# EAGLE design pm25-bme680 (EAGLE 9.3.2)
AUTHOR: Jared Wolff; BOARD_NUMBER: BRD-0010; COMPANY: Circuit Dojo; DOC_NUMBER: SCH-0010; DOC_REV: 1; TITLE: Particle^2 Sensor
Assembly variants: Production
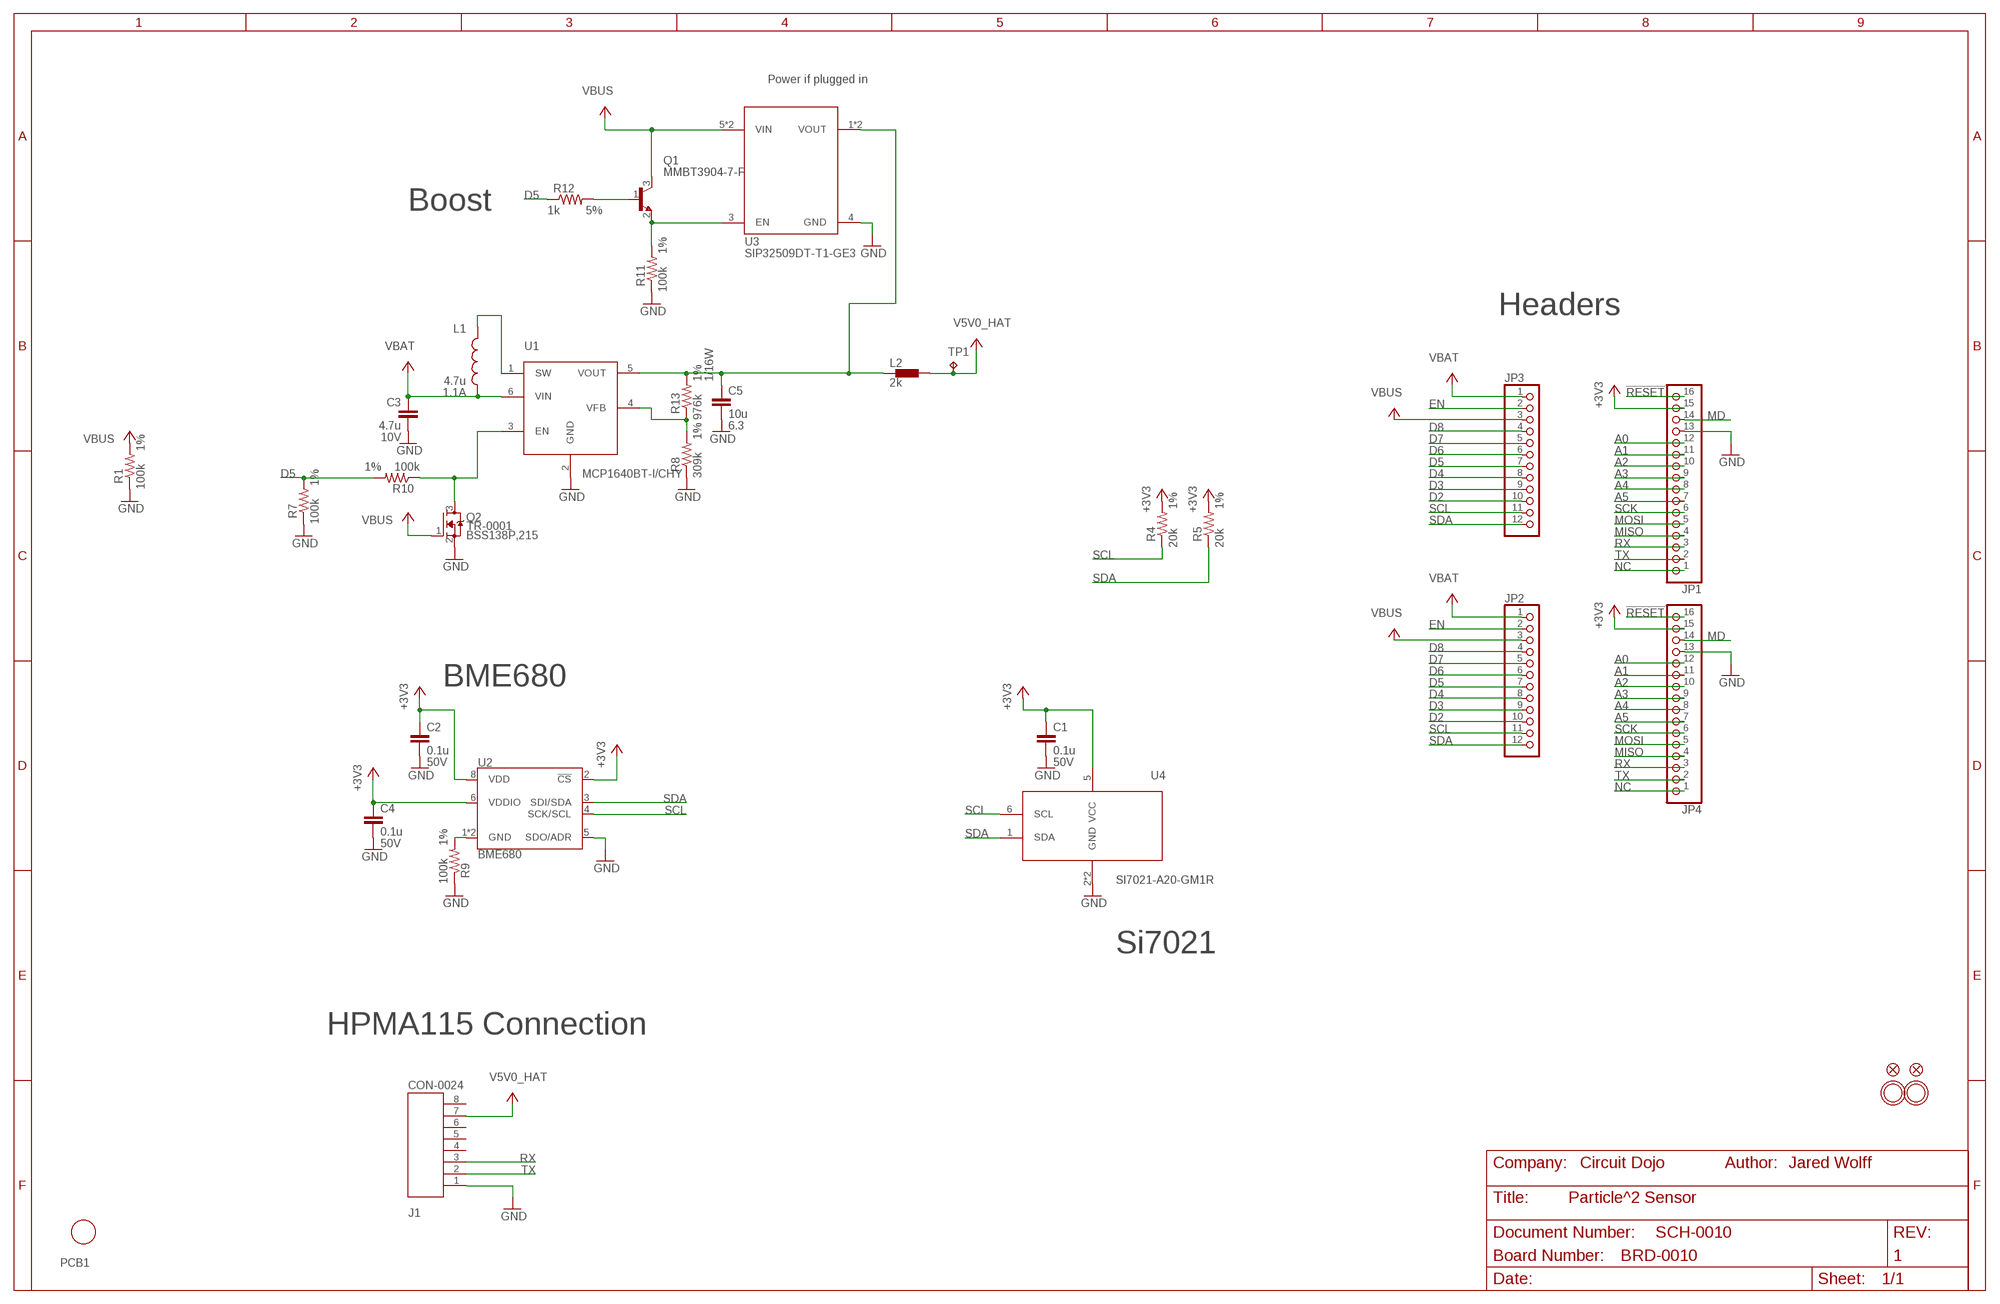
[diagram p0: schematic, sheet 1]

## Parts
C1  0.1u  CAP-0017  [CAPC1005X55N]  (not fitted in variant Production)
C2  0.1u  CAP-0017  [CAPC1005X55N]
C3  4.7u  CAP-0010  [C0603]
C4  0.1u  CAP-0017  [CAPC1005X55N]
C5  10u  CAP-10U-6.3V-0603  [C0603]
J1  CON-0024  [0532610871]
JP1  HEADER-1X16ROUND  [1X16_ROUND]
JP2  HEADER-1X12  [1X12_ROUND]  (not fitted in variant Production)
JP3  HEADER-1X12  [1X12_ROUND]
JP4  HEADER-1X16ROUND  [1X16_ROUND]  (not fitted in variant Production)
L1  4.7u  IND-0003  [IND-2P0X2P0X1P2]
L2  2k  FERRITE-0805  [R0805]
PCB1  PCB-BME680-SI7021  [PLACEHOLDER]
Q1  TRANSISTOR-NPN-40V-0.2A-SOT23  [SOT23]
Q2  TR-0001  [SOT23]
R1  100k  RES-0041  [R0402]  (not fitted in variant Production)
R4  20k  RES-0054  [R0402]
R5  20k  RES-0054  [R0402]
R7  100k  RES-0041  [R0402]
R8  309k  RES-309K-1%-0402  [R0402]
R9  100k  RES-0041  [R0402]
R10  100k  RES-0041  [R0402]
R11  100k  RES-0041  [R0402]
R12  1k  RES-0039  [R0402]
R13  976k  RES-976K-1%-0402  [R0402]
TP1  TP  [TP-1P27]
U1  POWER-VREG-FB-EN-SW-350MA  [SOT23-6]
U2  BME680  [LGA3.0X3.0]
U3  POWER-SWITCH-SIP32509DT  [SOT23-6]
U4  SI7021-A20-GM1R  [SON100P300X300X80-7N]  (not fitted in variant Production)
U$31  MOUNTINGHOLE2.5  [MOUNTINGHOLE_2.5_PLATED]
U$32  MOUNTINGHOLE2.5  [MOUNTINGHOLE_2.5_PLATED]
U$34  FIDUCIAL""  [FIDUCIAL_1MM]
U$35  FIDUCIAL""  [FIDUCIAL_1MM]

## Nets
!RESET: JP1.16 JP4.16
+3V3: C1.1 C2.1 C4.1 JP1.15 JP4.15 R4.2 R5.2 U2.2(!CS) U2.6(VDDIO) U2.8(VDD) U4.5(VCC)
A0: JP1.12 JP4.12
A1: JP1.11 JP4.11
A2: JP1.10 JP4.10
A3: JP1.9 JP4.9
A4: JP1.8 JP4.8
A5: JP1.7 JP4.7
D2: JP2.10 JP3.10
D3: JP2.9 JP3.9
D4: JP2.8 JP3.8
D5: JP2.7 JP3.7 R7.2 R10.2 R12.1
D6: JP2.6 JP3.6
D7: JP2.5 JP3.5
D8: JP2.4 JP3.4
EN: JP2.2 JP3.2
GND: C1.2 C2.2 C3.2 C4.2 C5.2 J1.1 JP1.13 JP4.13 Q2.2(S) R1.1 R7.1 R8.1 R9.1 R11.1 U1.2(GND) U2.5(SDO/ADR) U3.4(GND) U4.2(GND) U4.7(GND)
MD: JP1.14 JP4.14
MISO: JP1.4 JP4.4
MOSI: JP1.5 JP4.5
N$1: L1.P$1 U1.1(SW)
N$2: R8.2 R13.1 U1.4(VFB)
N$3: Q1.2(E) R11.2 U3.3(EN)
N$4: R9.2 U2.1(GND) U2.7(GND)
N$6: Q2.3(D) R10.1 U1.3(EN)
N$7: Q1.1(B) R12.2
NC: JP1.1 JP4.1
RX: J1.3 JP1.3 JP4.3
SCK: JP1.6 JP4.6
SCL: JP2.11 JP3.11 R4.1 U2.4(SCK/SCL) U4.6(SCL)
SDA: JP2.12 JP3.12 R5.1 U2.3(SDI/SDA) U4.1(SDA)
TX: J1.2 JP1.2 JP4.2
V5V0_BEAD: C5.1 L2.1 R13.2 U1.5(VOUT) U3.1(VOUT) U3.2(VOUT)
V5V0_HAT: J1.7 L2.2 TP1.P$1(TP) TP1.P$2(TP) TP1.TP
VBAT: C3.1 JP2.1 JP3.1 L1.P$2 U1.6(VIN)
VBUS: JP2.3 JP3.3 Q1.3(C) Q2.1(G) R1.2 U3.5(VIN) U3.6(VIN)
Unconnected: J1.4 J1.5 J1.6 J1.8

## Notes on the sheet
- Power if plugged in
- Boost
- Headers
- BME680
- Si7021
- HPMA115 Connection

## Library data of the parts
C1 C2 C4 = wolff-den:CAP-0017: CAP CER 0.1UF 35V X5R 0402; DESC: CAP CER 0.1UF 50V X5R 0402; DIGIKEYPN: 587-3499-1-ND; MF: Taiyo Yuden; MPN: UMK105BJ104KV-F; VOLTHIGH: 50V
C3 = wolff-den:CAP-0010: CAP CER 4.7UF 10V X5R 0603; DIGIKEYPN: 1276-6684-1-ND; MPN: CL10A475MP5LNNC; TEMPHIGH: 85; TEMPLOW: -55; VOLTHIGH: 10V
C5 = wolff-den:CAP: CAPACITOR; DESC: CAP CER 10UF 6.3V X5R 0603; DIGIKEYPN: 587-5869-1-ND; MPN: JMK107ABJ106MA-T; VOLTHIGH: 6.3
J1 = wolff-den:CON-0024; DESC: CONN HEADER SMD R/A 8POS 1.25MM; DIGIKEYPN: WM7626CT-ND; MPN: 0532610871
JP1 = microbuilder:HEADER-1X16: PIN HEADER; MPN: PPPC161LFBN-RC
JP2 = microbuilder:HEADER-1X12
JP3 = microbuilder:HEADER-1X12; MPN: PPPC121LFBN-RC
JP4 = microbuilder:HEADER-1X16: PIN HEADER
L1 = wolff-den:IND-0003: FIXED IND 4.7UH 750MA 390 MOHM; CURRENT: 1.1A; DIGIKEYPN: 587-4705-1-ND; MPN: NRV2012T4R7MGF
L2 = wolff-den:FERRITE: FERRITE BEAD; DESC: FERRITE BEAD 2 KOHM 0805 1LN; DIGIKEYPN: 1276-6330-1-ND; MPN: CIM21J202NE
PCB1 = wolff-den:PCB; MPN: BRD-0011
Q1 = wolff-den:TRANSISTOR: TRANSISTOR; DESC: TRANS NPN 40V 0.2A SMD SOT23-3; DIGIKEYPN: MMBT3904-FDICT-ND; MPN: MMBT3904-7-F
Q2 = wolff-den:TR-0001: MOSFET N-CH 60V 360MA TO-236AB; DIGIKEYPN: 1727-1142-1-ND; MPN: BSS138P,215; TEMPHIGH: 150; TEMPLOW: -55
R1 R7 R9-R11 = wolff-den:RES-0041: RES SMD 100K OHM 1% 1/16W 0402; DIGIKEYPN: 311-100KLRCT-ND; MPN: RC0402FR07100KL; TOLERANCE: 1%; VENDOR: Yageo
R4 R5 = wolff-den:RES-0054: RES SMD 20K OHM 1% 1/16W 0402; DIGIKEYPN: 311-20.0KLRCT-ND; MPN: RC0402FR-0720KL; TOLERANCE: 1%; VENDOR: Yageo
R8 = wolff-den:RES: RESISTOR; DESC: RES SMD 309K OHM 1% 1/16W 0402; DIGIKEYPN: YAG3108CT-ND; MPN: RC0402FR-07309KL; POWER: 1/16W; TOLERANCE: 1%
R12 = wolff-den:RES-0039: RES SMD 1K OHM 5% 1/16W 0402; DIGIKEYPN: 311-1.0KJRCT-ND; MPN: RC0402JR-071KL; TOLERANCE: 5%; VENDOR: Yageo
R13 = wolff-den:RES: RESISTOR; DESC: RES SMD 976K OHM 1% 1/16W 0402; DIGIKEYPN: YAG3265CT-ND; MPN: RC0402FR-07976KL; POWER: 1/16W; TOLERANCE: 1%
TP1 = wolff-den:TP: TEST POINT
U1 = wolff-den:POWER-VREG-FB-EN-SW: IC CONV BOOST SOT-23-6; DIGIKEYPN: MCP1640BT-I/CHYCT-ND; MPN: MCP1640BT-I/CHY; TEMPHIGH: 125; TEMPLOW: -40; VOLTHIGH: 5.5V; VOLTLOW: 0.8V
U2 = wolff-den:BME680: Bosch BME680 – Combined Humidity and Pressure Sensor The BME680 is as combined digital humidity, pressure and temperature sensor based on proven sensing principles. The sensor module is housed in an extremely compact metal-lid LGA package with a footprint of only 3.0×3.0mm with a height of 0.93mm. Its small dimensions and its low power consumption allow the implementation in battery driven devices such as handsets, GPS modules or watches.; DESC: SENSOR RH PRESSURE TEMP VOC; DIGIKEYPN: 828-1077-1-ND; MF: Bosch Sensortec; MPN: BME680
U3 = wolff-den:POWER-SWITCH: IC SWITCH; DESC: IC LOAD SWITCH SOT23-6; DIGIKEYPN: SIP32509DT-T1-GE3CT-ND; MPN: SIP32509DT-T1-GE3
U4 = wolff-den:SI7021-A20-GM1R; DESC: SENS HUMID/TEMP 3.6V I2C 2% 6DFN; DIGIKEYPN: 336-4380-1-ND; MPN: SI7021-A20-GM1R
U$31 U$32 = microbuilder:MOUNTINGHOLE: Mounting Hole For #2 screws (0.086"/2.18mm width, 0.094"/2.4mm hole) use 2.5mm; BOM: EXCLUDE
U$34 U$35 = microbuilder:FIDUCIAL: Fiducial Alignment Points Various fiducial points for machine vision alignment.; BOM: EXCLUDE

## Board
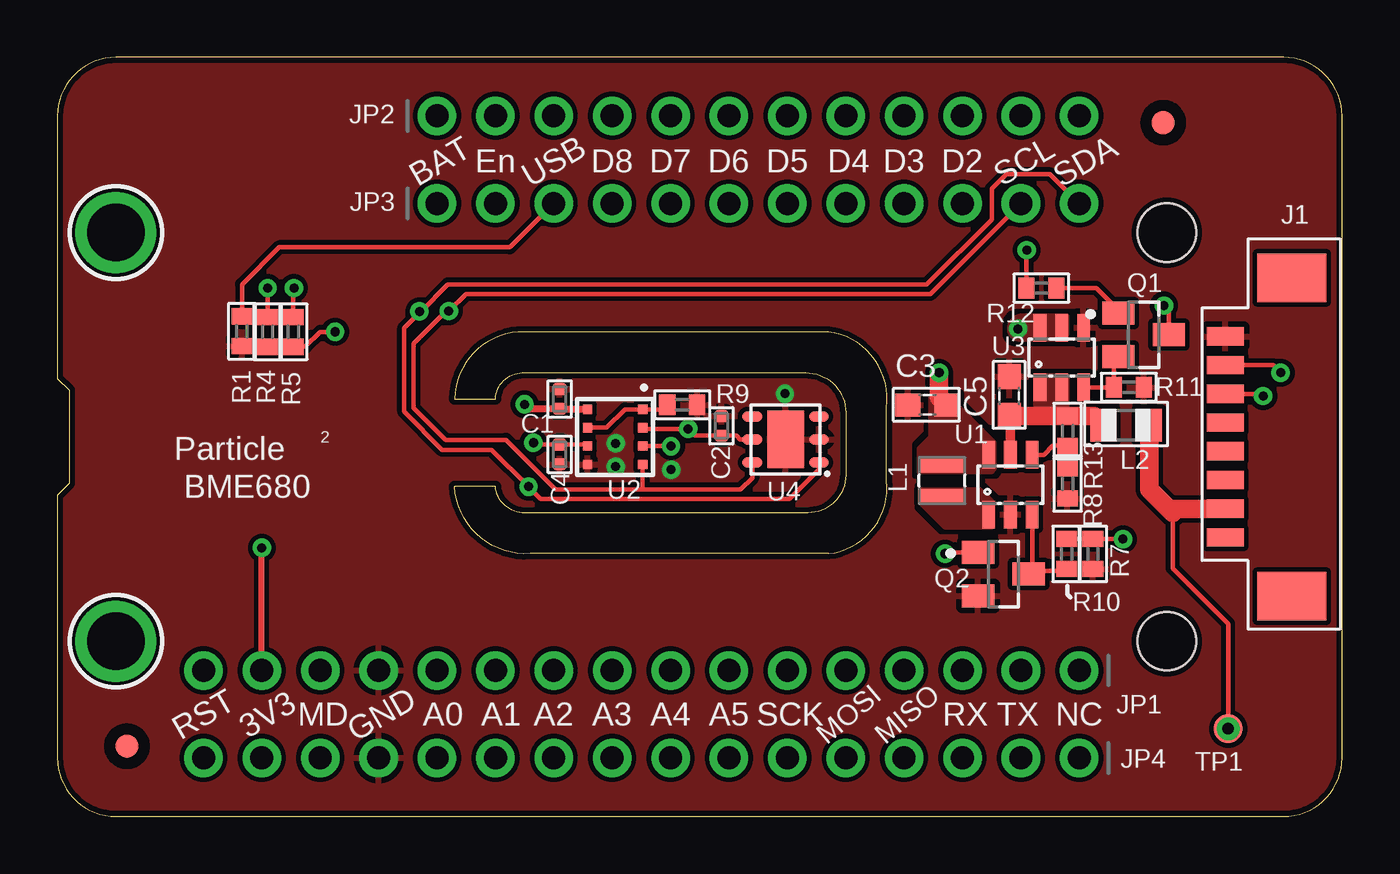
[diagram p1: board, top side]
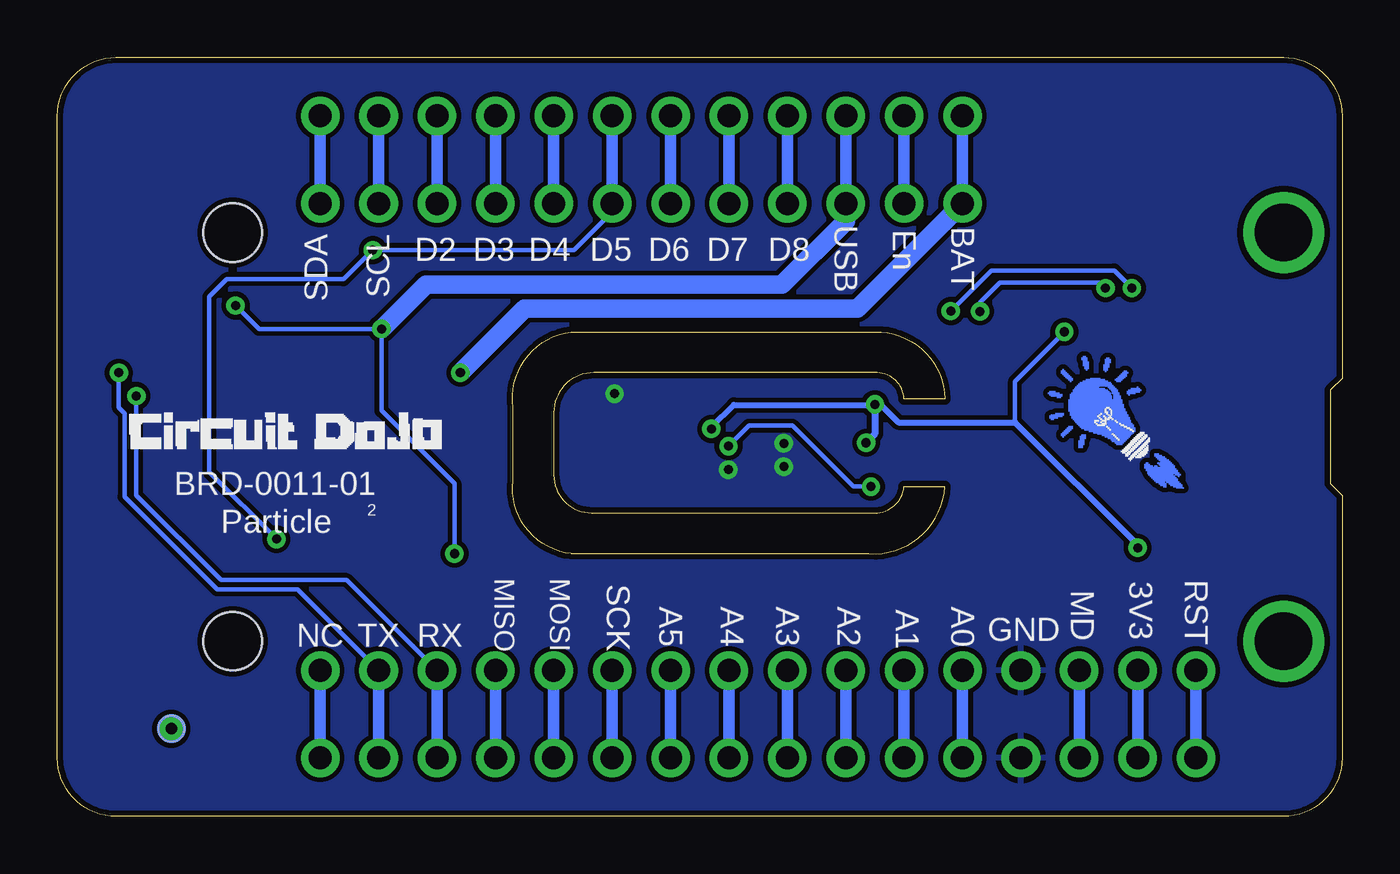
[diagram p2: board, bottom side, seen from below]

Size 55.88 x 33.02 mm. Coordinates in mm from the lower left corner, seen from the top.
Outline: 2.54,0 53.34,0 arc90 55.88,2.54 55.88,30.48 arc90 53.34,33.02 2.54,33.02 arc90 0,30.48 0,19.05 0.51,18.54 0.51,14.48 0,13.97 0,2.54 arc90 2.54,0
Outline: 33.53,11.43 20.57,11.43 arc-90 17.27,14.35 19.05,14.35 arc90 20.45,13.21 32.65,13.21 arc90 34.29,14.85 34.29,17.57 arc90 32.56,19.3 20.32,19.3 arc90 19.05,18.16 17.27,18.16 arc-90 20.32,21.08 33.53,21.08 arc-90 36.07,17.78 36.07,14.61 arc-90 33.53,11.43
Copper layers (1*16): Top 0.035mm / dielectric 1.5mm / Bottom 0.035mm
Design rules "adafruit *": minimum track width 8mil, minimum drill 15.5mil, track to track 8mil, track to pad 8mil, pad to pad 8mil, via to via 8mil, smd to smd 8mil, copper to edge 10mil, drill to drill 8mil, minimum pad ring 10mil, minimum via ring 8mil, stop-mask expansion 2mil, vias tented up to drill 20mil, thermal gap 10mil
Holes 2.54 mm at 48.26,25.4 48.26,7.62

### Footprints (pad centres in the part's own frame; a part is rotated, then mirrored left to right if it is on the bottom)
CAPC1005X55N = smd 0.54 x 0.6: 1 -0.43,0; 2 0.43,0
C0603 = smd 1.1 x 1: 1 -0.85,0; 2 0.85,0
0532610871 = smd 0.8 x 1.6: 1 4.375,0; 2 3.125,0; 3 1.875,0; 4 0.625,0; 5 -0.625,0; 6 -1.875,0; 7 -3.125,0; 8 -4.375,0 | smd 2.1 x 3: P$9 -6.925,-2.9; P$10 6.925,-2.9
1X16_ROUND = drill 1 pad 1.676: 1 -19.05,0; 2 -16.51,0; 3 -13.97,0; 4 -11.43,0; 5 -8.89,0; 6 -6.35,0; 7 -3.81,0; 8 -1.27,0; 9 1.27,0; 10 3.81,0; 11 6.35,0; 12 8.89,0; 13 11.43,0; 14 13.97,0; 15 16.51,0; 16 19.05,0
1X12_ROUND = drill 1 pad 1.676: 1 -13.97,0; 2 -11.43,0; 3 -8.89,0; 4 -6.35,0; 5 -3.81,0; 6 -1.27,0; 7 1.27,0; 8 3.81,0; 9 6.35,0; 10 8.89,0; 11 11.43,0; 12 13.97,0
IND-2P0X2P0X1P2 = smd 0.65 x 2: P$1 -0.675,0; P$2 0.675,0
R0805 = smd 1.1 x 1.4: 1 -1,0; 2 1,0
SOT23 = smd 1 x 1.4: 1 -0.95,-1.1; 2 0.95,-1.1; 3 0,1.1
R0402 = smd 0.7 x 0.9: 1 -0.65,0; 2 0.65,0
TP-1P27 = drill 0.5: P$1 0,0 | smd 1.27 x 1.27 bottom: P$2 0,0 | smd 1.27 x 1.27: TP 0,0
SOT23-6 = smd 0.55 x 1.2: 1 -0.95,-1.3; 2 0,-1.3; 3 0.95,-1.3; 4 0.95,1.3; 5 0,1.3; 6 -0.95,1.3
LGA3.0X3.0 = smd 0.4 x 0.4: 1 -1.2,1.2; 2 -0.4,1.2; 3 0.4,1.2; 4 1.2,1.2; 5 1.2,-1.2; 6 0.4,-1.2; 7 -0.4,-1.2; 8 -1.2,-1.2
SON100P300X300X80-7N = smd 0.85 x 0.45: 1 -1.45,1; 2 -1.45,0; 3 -1.45,-1; 4 1.45,-1; 5 1.45,0; 6 1.45,1 | smd 1.6 x 2.5: 7 0,0
MOUNTINGHOLE_2.5_PLATED = drill 2.5 pad 3.2: P$1 0,0
FIDUCIAL_1MM = smd 1 x 1: 1 0,0

### Placement (x,y rotation side)
C1  21.84,18.16 90 top
C2  28.88,16.99 90 top
C3  37.85,17.91 180 top
C4  21.84,15.75 270 top
C5  41.4,18.29 90 top
J1  50.8,16.51 90 top
JP1  25.4,6.35 180 top
JP2  30.48,30.48 0 top
JP3  30.48,26.67 0 top
JP4  25.4,2.54 180 top
L1  38.48,14.61 90 top
L2  46.48,17.02 0 top
PCB1  -12.93,0 0 top  (outside the outline)
Q1  47.24,20.95 270 top
Q2  41.15,10.54 270 top
R1  8.03,21.11 90 top
R4  9.14,21.08 270 top
R5  10.26,21.08 270 top
R7  45.04,11.41 90 top
R8  43.94,14.48 90 top
R9  27.18,17.91 180 top
R10  43.9,11.41 90 top
R11  46.61,18.67 180 top
R12  42.8,22.99 0 top
R13  43.94,16.76 90 top
TP1  50.93,3.81 180 top
U1  41.45,14.43 0 top
U2  24.26,16.51 270 top
U3  43.69,19.96 0 top
U4  31.68,16.4 180 top
U$31  2.54,25.4 270 top
U$32  2.54,7.62 270 top
U$34  3.02,3.05 270 top
U$35  48.1,30.18 270 top

### Tracks (layer width: path | path; a pad name or v marks a point on that pad's centre or on a via)
!RESET
  Bottom 0.508: JP1.16 JP4.16
+3V3  (via drill 0.39)
  Top 0.203: R4.2 R5.2 10.78,20.43 11.43,21.08 v12.08,21.08 | U4.5 29.7,16.41 29.54,16.56 C2.1 27.73,16.56 v27.43,16.86 25.51,16.86 U2.2 | 23.04,17.73 U2.8 | v20.7,16.26 20.78,16.18 C4.1 22.99,16.18 U2.6
  Top 0.254: JP1.15 v8.89,11.68
  Top 0.305: 23.04,17.73 C1.1 20.52,17.73 v20.32,17.93
  Bottom 0.203: 20.32,17.9 v20.32,17.93 | 14.22,17.14 14.22,18.92 v12.08,21.07 v12.08,21.08
  Bottom 0.254: v27.43,16.86 27.43,16.93 26.46,17.9 20.32,17.9 20.06,17.9 19.3,17.14 14.22,17.14 8.89,11.81 v8.89,11.68
  Bottom 0.305: v20.32,17.93 20.32,16.64 v20.7,16.26
  Bottom 0.508: JP1.15 JP4.15
A0
  Bottom 0.508: JP1.12 JP4.12
A1
  Bottom 0.508: JP1.11 JP4.11
A2
  Bottom 0.508: JP1.10 JP4.10
A3
  Bottom 0.508: JP1.9 JP4.9
A4
  Bottom 0.508: JP1.8 JP4.8
A5
  Bottom 0.508: JP1.7 JP4.7
D2
  Bottom 0.508: JP2.10 JP3.10
D3
  Bottom 0.508: JP2.9 JP3.9
D4
  Bottom 0.508: JP2.8 JP3.8
D5  (via drill 0.39)
  Top 0.203: R10.2 R7.2 v46.35,12.06 | v42.16,24.64 42.15,24.62 R12.1
  Bottom 0.203: JP3.7 31.75,26.29 33.4,24.64 v42.16,24.64 43.43,23.37 48.51,23.37 49.28,22.61 49.28,14.99 v46.35,12.06
  Bottom 0.508: JP2.7 JP3.7
D6
  Bottom 0.508: JP3.6 JP2.6
D7
  Bottom 0.508: JP2.5 JP3.5
D8
  Bottom 0.508: JP3.4 JP2.4
EN
  Bottom 0.508: JP2.2 JP3.2
GND  (via drill 0.39)
  other vias: 31.65,18.39 26.7,15.09 24.28,15.21 24.28,16.23
  pour Top (rank 2): 0,33.02 0,0 55.88,0 55.88,33.02
  pour Bottom (rank 2): 55.88,0 0,0 0,33.02 55.88,33.02
MD
  Bottom 0.508: JP1.14 JP4.14
MISO
  Bottom 0.508: JP1.4 JP4.4
MOSI
  Bottom 0.508: JP1.5 JP4.5
N$1
  pour Top (no thermals): 37.59,14.22 37.59,13.59 38.61,12.57 40.64,12.57 40.64,13.72 40.13,14.22
N$2
  Top 0.203: R8.2 R13.1 43.93,16.13 43.31,16.13 42.91,15.73 U1.4
N$3
  Top 0.203: Q1.2 45.96,19.82 R11.2 U3.3
N$4
  Top 0.203: U2.7 23.89,16.91 24.7,17.71 U2.1 26.33,17.71 R9.2
N$6
  Top 0.203: U1.3 42.4,10.7 42.4,10.69 | 42.4,10.69 Q2.3 | R10.1 43.82,10.69 42.4,10.69
N$7
  Top 0.203: Q1.1 46.14,22.03 45.19,22.99 R12.2
NC
  Bottom 0.508: JP4.1 JP1.1
RX  (via drill 0.39)
  Top 0.203: J1.3 52.35,18.39 v52.45,18.29
  Bottom 0.203: JP1.3 43.31,10.29 48.77,10.29 52.45,13.97 v52.45,18.29
  Bottom 0.508: JP1.3 JP4.3
SCK
  Bottom 0.508: JP1.6 JP4.6
SCL  (via drill 0.39)
  Top 0.203: JP3.11 37.97,22.73 17.77,22.73 v17.02,21.98 16.9,21.98 15.49,20.57 15.49,17.77 16.89,16.38 19.51,16.38 21.67,14.22 25.53,14.22 | v9.14,22.99 R4.1 | U4.6 30.23,14.73 29.72,14.22 25.53,14.22 | U2.4 25.46,14.29 25.53,14.22
  Bottom 0.203: v17.02,21.98 15.25,23.75 9.91,23.75 v9.14,22.99
  Bottom 0.508: JP3.11 JP2.11
SDA  (via drill 0.39)
  Top 0.203: U4.1 33.13,15.09 31.85,13.82 21.02,13.82 v20.5,14.35 v20.48,14.35 18.88,15.95 16.74,15.95 15.09,17.61 15.09,21.25 15.75,21.91 v15.75,21.97 15.81,21.97 16.98,23.14 37.8,23.14 40.64,25.98 40.64,27.3 41.27,27.94 43.18,27.94 JP3.12 | v10.29,22.99 10.26,22.96 R5.1 | U2.3 v26.69,16.11
  Bottom 0.203: v15.75,21.97 15.75,22.35 14.88,23.22 10.52,23.22 v10.29,22.99 | v26.69,16.11 25.8,17 23.91,17 21.26,14.35 v20.5,14.35
  Bottom 0.508: JP3.12 JP2.12
TX  (via drill 0.39)
  Top 0.203: J1.2 52.88,19.64 v53.21,19.3
  Bottom 0.203: JP1.2 45.44,9.88 48.94,9.88 52.96,13.9 52.96,17.53 53.21,17.78 v53.21,19.3
  Bottom 0.508: JP1.2 JP4.2
V5V0_BEAD
  Top 0.406: U1.5 41.45,17.39 C5.1
  Top 0.813: L2.1 45.09,17.41 R13.2 41.48,17.41 41.45,17.39
  pour Top (no thermals): 42.55,19.18 42.55,17.53 43.94,17.53 43.94,19.18
V5V0_HAT
  Top 0.203: L2.2 47.5,17 | TP1.P$1 50.93,8.38 48.51,10.79 48.51,13.21
  Top 0.8: 47.5,17 47.5,14.22 47.94,13.78 48.34,13.38 | 48.51,13.21 48.34,13.38 | J1.7 48.34,13.38
VBAT  (via drill 0.39)
  Top 0.813: v38.35,19.3 38.35,18.25 C3.1
  Bottom 0.508: JP2.1 JP3.1
  Bottom 0.813: JP3.1 21.08,22.1 35.56,22.1 v38.35,19.3
  pour Top (no thermals): 37.47,16 37.47,14.99 40.64,14.99 40.77,15.11 40.77,16.26 38.99,18.03 38.99,18.29 37.97,18.29 37.97,16.51
VBUS  (via drill 0.39)
  Top 0.203: R1.2 8.03,23.14 9.65,24.77 19.68,24.77 JP3.3 | v38.61,11.43 38.67,11.49 Q2.1 | 41.91,21.08 v41.78,21.21 | v48.13,22.23 48.34,22.01 Q1.3
  Bottom 0.203: v38.61,11.43 38.61,14.48 41.78,17.65 v41.78,21.21 47.12,21.21 v48.13,22.23
  Bottom 0.508: JP2.3 JP3.3
  Bottom 0.813: JP3.3 21.59,25.91 24.36,23.14 39.85,23.14 v41.78,21.21
  pour Top (no thermals): 43.92,21.79 41.99,21.79 arc90 41.4,21.21 arc90 41.86,20.75 43.92,20.75
(copper drawn outside any net)
  shapes: Bottom area x321

### Text on the board
tPlace: BAT | En | USB | D8 | D7 | D6 | D5 | D4 | D3 | D2 | SCL | SDA | 2 | Particle | BME680 | RST | 3V3 | MD | GND | A0 | A1 | A2 | A3 | A4 | A5 | SCK | MOSI | MISO | RX | TX | NC
bPlace: En | D8 | D7 | D6 | D5 | D4 | D3 | D2 | BAT | USB | SCL | SDA | BRD-0011-01 | 2 | Particle | RST | 3V3 | MD | SCK | MOSI | MISO | GND | A0 | A1 | A2 | A3 | A4 | A5 | RX | TX | NC